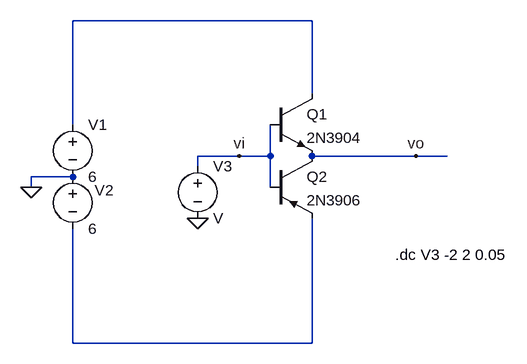
[diagram p0: schematic Draft1.asc]
Draft1.asc, the LTspice schematic file:
Version 4
SHEET 1 880 680
WIRE 288 32 -80 32
WIRE 288 144 288 32
WIRE -80 192 -80 32
WIRE 176 240 112 240
WIRE 224 240 224 192
WIRE 224 240 176 240
WIRE 448 240 288 240
WIRE 496 240 448 240
WIRE 112 256 112 240
WIRE -80 272 -144 272
WIRE -144 288 -144 272
WIRE 224 288 224 240
WIRE -80 528 -80 352
WIRE 288 528 288 336
WIRE 288 528 -80 528
FLAG 112 336 0
FLAG -144 288 0
FLAG 448 240 vo
FLAG 176 240 vi
SYMBOL Voltage -80 176 R0
SYMATTR InstName V1
SYMATTR Value 6
SYMBOL Voltage -80 256 R0
WINDOW 0 34 37 Left 2
SYMATTR InstName V2
SYMATTR Value 6
SYMBOL npn 224 144 R0
SYMATTR InstName Q1
SYMATTR Value 2N3904
SYMBOL pnp 224 240 R0
SYMATTR InstName Q2
SYMATTR Value 2N3906
SYMBOL Voltage 112 240 R0
SYMATTR InstName V3
TEXT 416 392 Left 2 !.dc V3 -2 2 0.05

The netlist it stands for:
* Draft1.asc
V1 N001 0 6
V2 0 N002 6
Q1 N001 vi vo 0 2N3904
Q2 vo vi N002 0 2N3906
V3 vi 0 V
.model NPN NPN
.model PNP PNP
.lib standard.bjt
.dc V3 -2 2 0.05
.backanno
.end